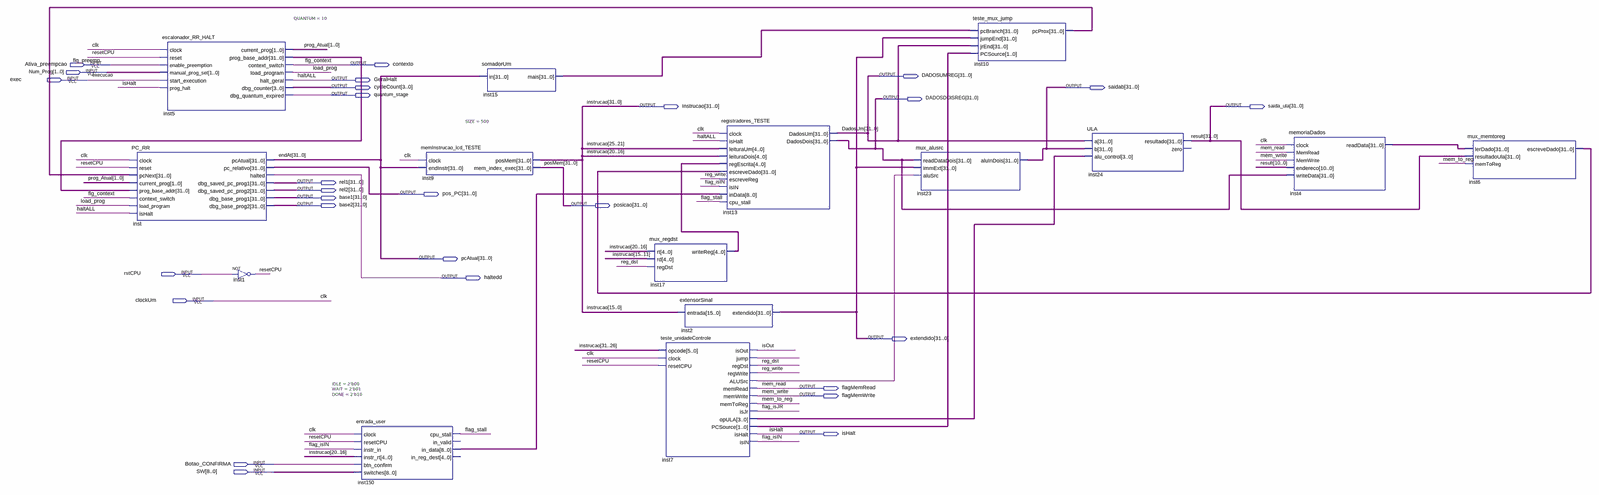
[diagram p0: schematic sheet, whole]
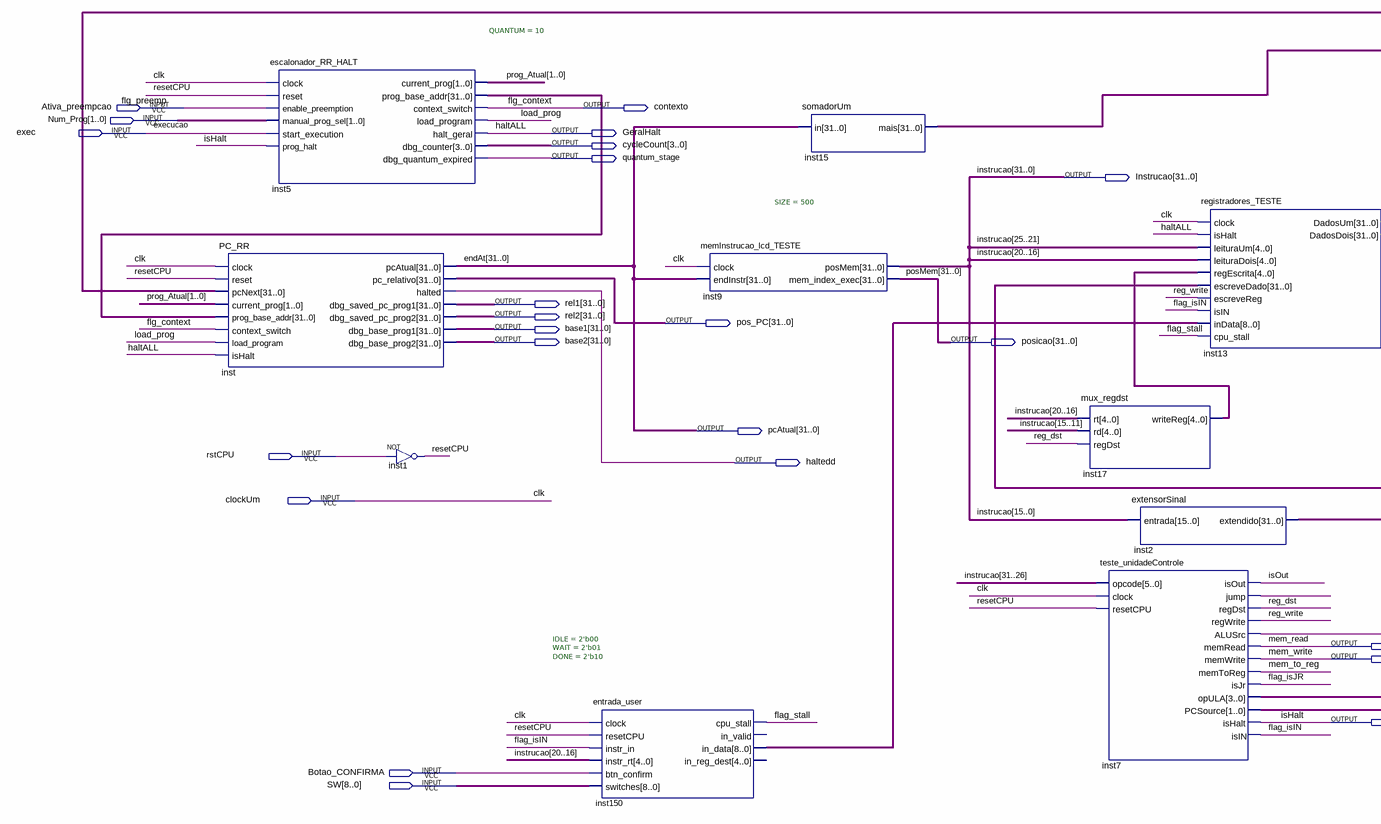
[diagram p1: schematic sheet, left part]
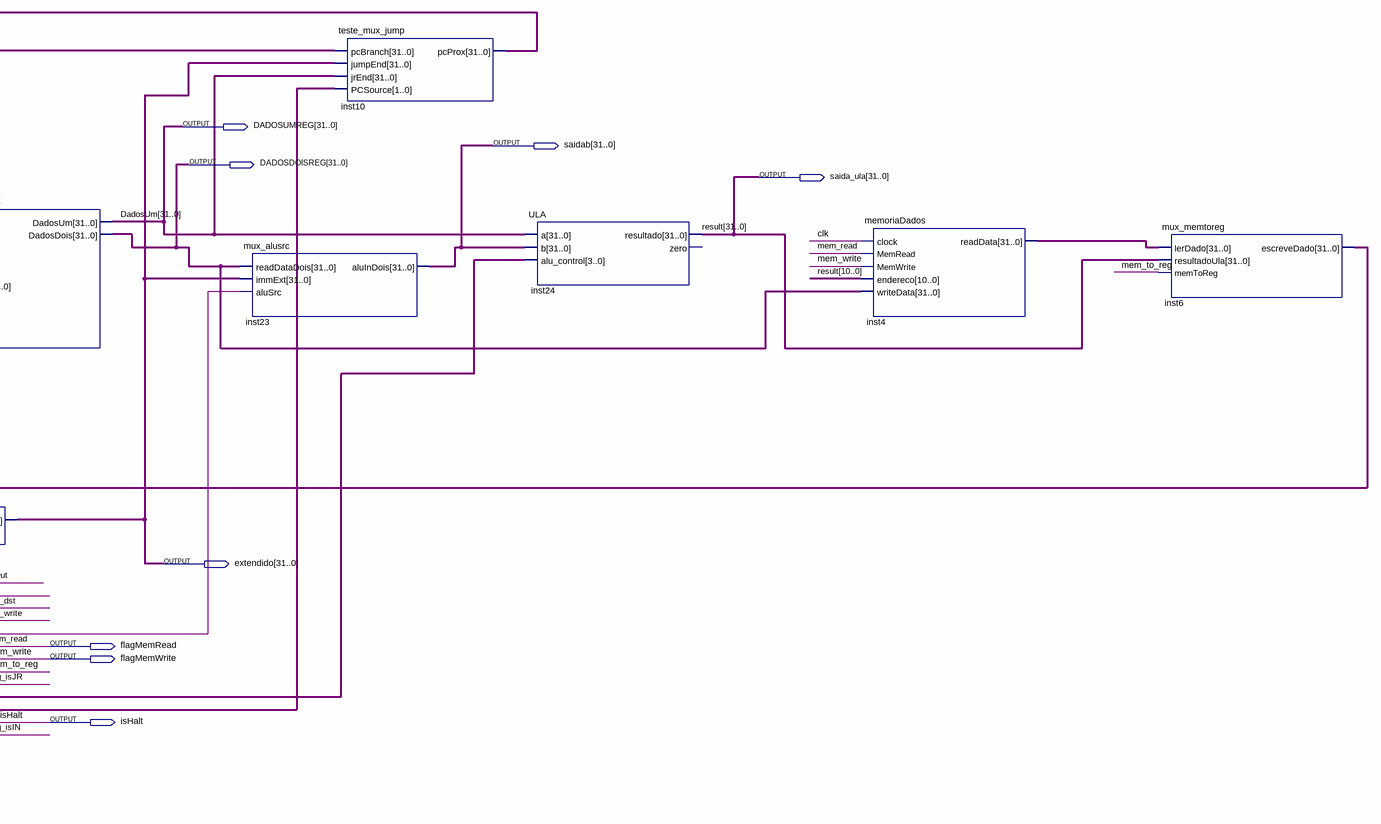
[diagram p2: schematic sheet, right part]
// Quartus schematic teste_Escalona_E_Progs_TESTE_HALT.bdf as structural Verilog: 15 symbols, 28 pins
module teste_Escalona_E_Progs_TESTE_HALT (
  input  Ativa_preempcao,
  input  [1:0] Num_Prog,
  input  exec,
  input  rstCPU,
  input  clockUm,
  input  Botao_CONFIRMA,
  input  [8:0] SW,
  output contexto,
  output [31:0] DADOSUMREG,
  output GeralHalt,
  output [3:0] cycleCount,
  output [31:0] saidab,
  output quantum_stage,
  output [31:0] DADOSDOISREG,
  output [31:0] Instrucao,
  output [31:0] saida_ula,
  output [31:0] rel1,
  output [31:0] rel2,
  output [31:0] pos_PC,
  output [31:0] base1,
  output [31:0] base2,
  output [31:0] posicao,
  output [31:0] pcAtual,
  output haltedd,
  output [31:0] extendido,
  output flagMemRead,
  output flagMemWrite,
  output isHalt
);

  wire flag_isIN, flag_isJR, flag_stall, inst7_alusrc, inst7_jump, isOut, load_prog, mem_to_reg, reg_dst,
       reg_write, resetCPU;
  wire [1:0] inst7_pcsource, prog_Atual;
  wire [3:0] inst7_opula;
  wire [4:0] inst17_writereg;
  wire [8:0] inst150_in_data;
  wire [31:0] inst4_readdata, inst5_prog_base_addr, inst6_escrevedado, inst10_pcprox, inst15_mais;

  PC_RR inst (
    .clock(clockUm), .reset(resetCPU), .pcNext(inst10_pcprox), .current_prog(prog_Atual),
    .prog_base_addr(inst5_prog_base_addr), .context_switch(contexto), .load_program(load_prog),
    .isHalt(GeralHalt), .pcAtual(pcAtual), .pc_relativo(pos_PC), .halted(haltedd), .dbg_saved_pc_prog1(rel1),
    .dbg_saved_pc_prog2(rel2), .dbg_base_prog1(base1), .dbg_base_prog2(base2));
  escalonador_RR_HALT #(.QUANTUM(10)) inst5 (
    .clock(clockUm), .reset(resetCPU), .enable_preemption(Ativa_preempcao), .manual_prog_sel(Num_Prog),
    .start_execution(exec), .prog_halt(isHalt), .current_prog(prog_Atual),
    .prog_base_addr(inst5_prog_base_addr), .context_switch(contexto), .load_program(load_prog),
    .halt_geral(GeralHalt), .dbg_counter(cycleCount), .dbg_quantum_expired(quantum_stage));
  not inst1 (resetCPU, rstCPU);
  entrada_user #(.IDLE(2'b00), .WAIT(2'b01), .DONE(2'b10)) inst150 (
    .clock(clockUm), .resetCPU(resetCPU), .instr_in(flag_isIN), .instr_rt(Instrucao[20:16]),
    .btn_confirm(Botao_CONFIRMA), .switches(SW), .cpu_stall(flag_stall), .in_data(inst150_in_data));  // open: in_valid, in_reg_dest
  memInstrucao_lcd_TESTE #(.SIZE(500)) inst9 (
    .clock(clockUm), .endInstr(pcAtual), .posMem(Instrucao), .mem_index_exec(posicao));
  somadorUm inst15 (.in(pcAtual), .mais(inst15_mais));
  mux_regdst inst17 (.rt(Instrucao[20:16]), .rd(Instrucao[15:11]), .regDst(reg_dst), .writeReg(inst17_writereg));
  teste_unidadeControle inst7 (
    .opcode(Instrucao[31:26]), .clock(clockUm), .resetCPU(resetCPU), .isOut(isOut), .jump(inst7_jump),
    .regDst(reg_dst), .regWrite(reg_write), .ALUSrc(inst7_alusrc), .memRead(flagMemRead),
    .memWrite(flagMemWrite), .memToReg(mem_to_reg), .isJr(flag_isJR), .opULA(inst7_opula),
    .PCSource(inst7_pcsource), .isHalt(isHalt), .isIN(flag_isIN));
  extensorSinal inst2 (.entrada(Instrucao[15:0]), .extendido(extendido));
  registradores_TESTE inst13 (
    .clock(clockUm), .isHalt(GeralHalt), .leituraUm(Instrucao[25:21]), .leituraDois(Instrucao[20:16]),
    .regEscrita(inst17_writereg), .escreveDado(inst6_escrevedado), .escreveReg(reg_write), .isIN(flag_isIN),
    .inData(inst150_in_data), .cpu_stall(flag_stall), .DadosUm(DADOSUMREG), .DadosDois(DADOSDOISREG));
  mux_alusrc inst23 (.readDataDois(DADOSDOISREG), .immExt(extendido), .aluSrc(inst7_alusrc), .aluInDois(saidab));
  teste_mux_jump inst10 (
    .pcBranch(inst15_mais), .jumpEnd(extendido), .jrEnd(DADOSUMREG), .PCSource(inst7_pcsource),
    .pcProx(inst10_pcprox));
  ULA inst24 (.a(DADOSUMREG), .b(saidab), .alu_control(inst7_opula), .resultado(saida_ula));  // open: zero
  memoriaDados inst4 (
    .clock(clockUm), .MemRead(flagMemRead), .MemWrite(flagMemWrite), .endereco(saida_ula[10:0]),
    .writeData(DADOSDOISREG), .readData(inst4_readdata));
  mux_memtoreg inst6 (
    .lerDado(inst4_readdata), .resultadoUla(saida_ula), .memToReg(mem_to_reg), .escreveDado(inst6_escrevedado));

  // Other names for the same wires on the sheet: clk = clockUm; DadosUm[31:0] = DADOSUMREG; execucao = exec;
  //   flg_context = contexto; flg_preemp = Ativa_preempcao; haltALL = GeralHalt; mem_read = flagMemRead;
  //   mem_write = flagMemWrite; endAt[31:0] = pcAtual; posMem[31:0] = posicao; result[31:0] = saida_ula
endmodule
